# EAGLE schematic mother (EAGLE 9.3.0)
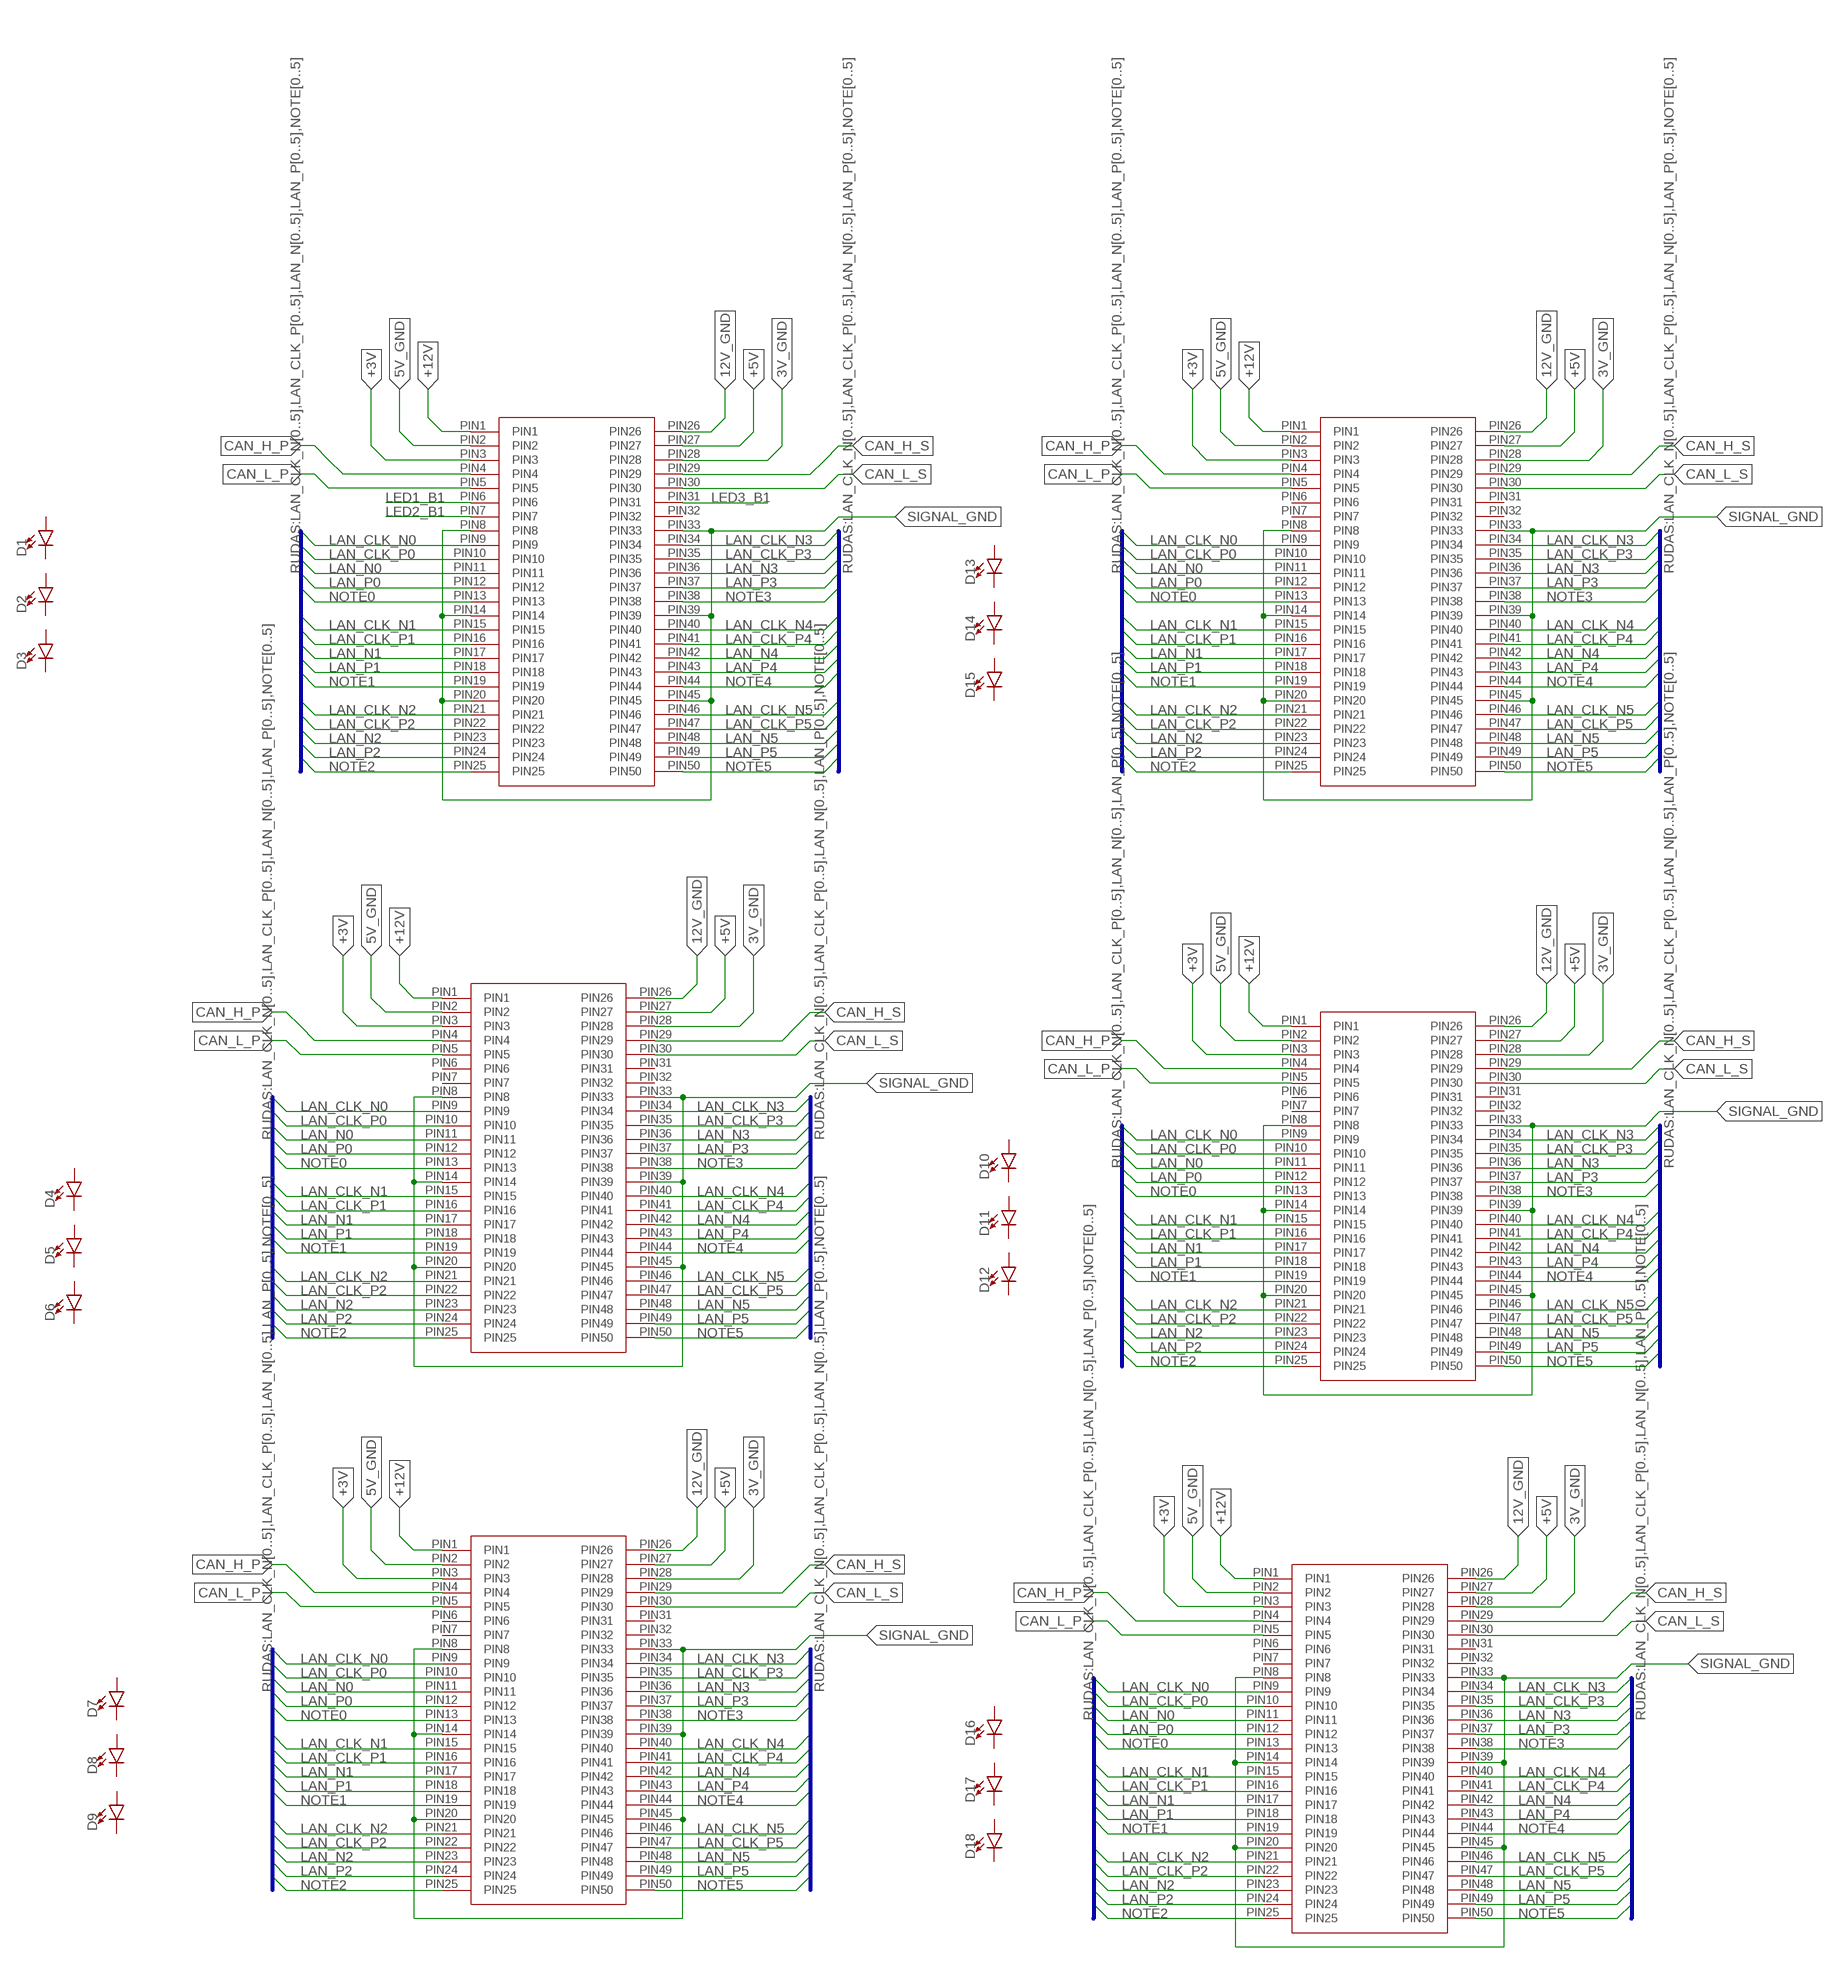
[diagram p0: schematic, sheet 1]

## Parts
D1  LED-FKIT-1206  [FKIT-LED-1206]
D2  LED-FKIT-1206  [FKIT-LED-1206]
D3  LED-FKIT-1206  [FKIT-LED-1206]
D4  LED-FKIT-1206  [FKIT-LED-1206]
D5  LED-FKIT-1206  [FKIT-LED-1206]
D6  LED-FKIT-1206  [FKIT-LED-1206]
D7  LED-FKIT-1206  [FKIT-LED-1206]
D8  LED-FKIT-1206  [FKIT-LED-1206]
D9  LED-FKIT-1206  [FKIT-LED-1206]
D10  LED-FKIT-1206  [FKIT-LED-1206]
D11  LED-FKIT-1206  [FKIT-LED-1206]
D12  LED-FKIT-1206  [FKIT-LED-1206]
D13  LED-FKIT-1206  [FKIT-LED-1206]
D14  LED-FKIT-1206  [FKIT-LED-1206]
D15  LED-FKIT-1206  [FKIT-LED-1206]
D16  LED-FKIT-1206  [FKIT-LED-1206]
D17  LED-FKIT-1206  [FKIT-LED-1206]
D18  LED-FKIT-1206  [FKIT-LED-1206]
U$1  CARD_EDGE_50PINM80-4115042  [M80-4115042]
U$2  CARD_EDGE_50PINM80-4115042  [M80-4115042]
U$3  CARD_EDGE_50PINM80-4115042  [M80-4115042]
U$4  CARD_EDGE_50PINM80-4115042  [M80-4115042]
U$5  CARD_EDGE_50PINM80-4115042  [M80-4115042]
U$6  CARD_EDGE_50PINM80-4115042  [M80-4115042]

## Nets
3V_GND: U$1.PIN28 U$2.PIN28 U$3.PIN28 U$4.PIN28 U$5.PIN28 U$6.PIN28
5V_GND: U$1.PIN2 U$2.PIN2 U$3.PIN2 U$4.PIN2 U$5.PIN2 U$6.PIN2
12V_GND: U$1.PIN26 U$2.PIN26 U$3.PIN26 U$4.PIN26 U$5.PIN26 U$6.PIN26
+3V: U$1.PIN3 U$2.PIN3 U$3.PIN3 U$4.PIN3 U$5.PIN3 U$6.PIN3
+5V: U$1.PIN27 U$2.PIN27 U$3.PIN27 U$4.PIN27 U$5.PIN27 U$6.PIN27
+12V: U$1.PIN1 U$2.PIN1 U$3.PIN1 U$4.PIN1 U$5.PIN1 U$6.PIN1
CAN_H_P: U$1.PIN4 U$2.PIN4 U$3.PIN4 U$4.PIN4 U$5.PIN4 U$6.PIN4
CAN_H_S: U$1.PIN29 U$2.PIN29 U$3.PIN29 U$4.PIN29 U$5.PIN29 U$6.PIN29
CAN_L_P: U$1.PIN5 U$2.PIN5 U$3.PIN5 U$4.PIN5 U$5.PIN5 U$6.PIN5
CAN_L_S: U$1.PIN30 U$2.PIN30 U$3.PIN30 U$4.PIN30 U$5.PIN30 U$6.PIN30
LAN_CLK_N0: U$1.PIN9 U$2.PIN9 U$3.PIN9 U$4.PIN9 U$5.PIN9 U$6.PIN9
LAN_CLK_N1: U$1.PIN15 U$2.PIN15 U$3.PIN15 U$4.PIN15 U$5.PIN15 U$6.PIN15
LAN_CLK_N2: U$1.PIN21 U$2.PIN21 U$3.PIN21 U$4.PIN21 U$5.PIN21 U$6.PIN21
LAN_CLK_N3: U$1.PIN34 U$2.PIN34 U$3.PIN34 U$4.PIN34 U$5.PIN34 U$6.PIN34
LAN_CLK_N4: U$1.PIN40 U$2.PIN40 U$3.PIN40 U$4.PIN40 U$5.PIN40 U$6.PIN40
LAN_CLK_N5: U$1.PIN46 U$2.PIN46 U$3.PIN46 U$4.PIN46 U$5.PIN46 U$6.PIN46
LAN_CLK_P0: U$1.PIN10 U$2.PIN10 U$3.PIN10 U$4.PIN10 U$5.PIN10 U$6.PIN10
LAN_CLK_P1: U$1.PIN16 U$2.PIN16 U$3.PIN16 U$4.PIN16 U$5.PIN16 U$6.PIN16
LAN_CLK_P2: U$1.PIN22 U$2.PIN22 U$3.PIN22 U$4.PIN22 U$5.PIN22 U$6.PIN22
LAN_CLK_P3: U$1.PIN35 U$2.PIN35 U$3.PIN35 U$4.PIN35 U$5.PIN35 U$6.PIN35
LAN_CLK_P4: U$1.PIN41 U$2.PIN41 U$3.PIN41 U$4.PIN41 U$5.PIN41 U$6.PIN41
LAN_CLK_P5: U$1.PIN47 U$2.PIN47 U$3.PIN47 U$4.PIN47 U$5.PIN47 U$6.PIN47
LAN_N0: U$1.PIN11 U$2.PIN11 U$3.PIN11 U$4.PIN11 U$5.PIN11 U$6.PIN11
LAN_N1: U$1.PIN17 U$2.PIN17 U$3.PIN17 U$4.PIN17 U$5.PIN17 U$6.PIN17
LAN_N2: U$1.PIN23 U$2.PIN23 U$3.PIN23 U$4.PIN23 U$5.PIN23 U$6.PIN23
LAN_N3: U$1.PIN36 U$2.PIN36 U$3.PIN36 U$4.PIN36 U$5.PIN36 U$6.PIN36
LAN_N4: U$1.PIN42 U$2.PIN42 U$3.PIN42 U$4.PIN42 U$5.PIN42 U$6.PIN42
LAN_N5: U$1.PIN48 U$2.PIN48 U$3.PIN48 U$4.PIN48 U$5.PIN48 U$6.PIN48
LAN_P0: U$1.PIN12 U$2.PIN12 U$3.PIN12 U$4.PIN12 U$5.PIN12 U$6.PIN12
LAN_P1: U$1.PIN18 U$2.PIN18 U$3.PIN18 U$4.PIN18 U$5.PIN18 U$6.PIN18
LAN_P2: U$1.PIN24 U$2.PIN24 U$3.PIN24 U$4.PIN24 U$5.PIN24 U$6.PIN24
LAN_P3: U$1.PIN37 U$2.PIN37 U$3.PIN37 U$4.PIN37 U$5.PIN37 U$6.PIN37
LAN_P4: U$1.PIN43 U$2.PIN43 U$3.PIN43 U$4.PIN43 U$5.PIN43 U$6.PIN43
LAN_P5: U$1.PIN49 U$2.PIN49 U$3.PIN49 U$4.PIN49 U$5.PIN49 U$6.PIN49
LED1_B1: U$5.PIN6
LED2_B1: U$5.PIN7
LED3_B1: U$5.PIN31
NOTE0: U$1.PIN13 U$2.PIN13 U$3.PIN13 U$4.PIN13 U$5.PIN13 U$6.PIN13
NOTE1: U$1.PIN19 U$2.PIN19 U$3.PIN19 U$4.PIN19 U$5.PIN19 U$6.PIN19
NOTE2: U$1.PIN25 U$2.PIN25 U$3.PIN25 U$4.PIN25 U$5.PIN25 U$6.PIN25
NOTE3: U$1.PIN38 U$2.PIN38 U$3.PIN38 U$4.PIN38 U$5.PIN38 U$6.PIN38
NOTE4: U$1.PIN44 U$2.PIN44 U$3.PIN44 U$4.PIN44 U$5.PIN44 U$6.PIN44
NOTE5: U$1.PIN50 U$2.PIN50 U$3.PIN50 U$4.PIN50 U$5.PIN50 U$6.PIN50
SIGNAL_GND: U$1.PIN8 U$1.PIN14 U$1.PIN20 U$1.PIN33 U$1.PIN39 U$1.PIN45 U$2.PIN8 U$2.PIN14 U$2.PIN20 U$2.PIN33 U$2.PIN39 U$2.PIN45 U$3.PIN8 U$3.PIN14 U$3.PIN20 U$3.PIN33 U$3.PIN39 U$3.PIN45 U$4.PIN8 U$4.PIN14 U$4.PIN20 U$4.PIN33 U$4.PIN39 U$4.PIN45 U$5.PIN8 U$5.PIN14 U$5.PIN20 U$5.PIN33 U$5.PIN39 U$5.PIN45 U$6.PIN8 U$6.PIN14 U$6.PIN20 U$6.PIN33 U$6.PIN39 U$6.PIN45
Unconnected: D1.A D1.C D2.A D2.C D3.A D3.C D4.A D4.C D5.A D5.C D6.A D6.C D7.A D7.C D8.A D8.C D9.A D9.C D10.A D10.C D11.A D11.C D12.A D12.C D13.A D13.C D14.A D14.C D15.A D15.C D16.A D16.C D17.A D17.C D18.A D18.C U$1.PIN6 U$1.PIN7 U$1.PIN31 U$1.PIN32 U$2.PIN6 U$2.PIN7 U$2.PIN31 U$2.PIN32 U$3.PIN6 U$3.PIN7 U$3.PIN31 U$3.PIN32 U$4.PIN6 U$4.PIN7 U$4.PIN31 U$4.PIN32 U$5.PIN32 U$6.PIN6 U$6.PIN7 U$6.PIN31 U$6.PIN32

## Buses
RUDAS:LAN_CLK_N[0..5],LAN_CLK_P[0..5],LAN_N[0..5],LAN_P[0..5],NOTE[0..5]

## Library data of the parts
D1-D18 = SparkFun-LED:LED: LED (Generic) Standard schematic elements and footprints for 5mm, 3mm, 1206, and 0603 sized LEDs. Generic LEDs with no color specified.
U$1-U$6 = ORBIT-CON-HARWIN-101LOK:CARD_EDGE_50PIN: ORBIT-CON-HARWIN-101LOK-M80-4115042 Description: Headers & Wire Housings 25+25 POS FEM WO J/S 4.5mm TAIL TIN Website: https://www.mouser.com/ProductDetail/Harwin/M80-4115042?qs=sGAEpiMZZMs%252BGHln7q6pmzlZUuX%2F53qjVusOkRqubuw%3D